# EAGLE schematic Shutter v1 (EAGLE 5.10)
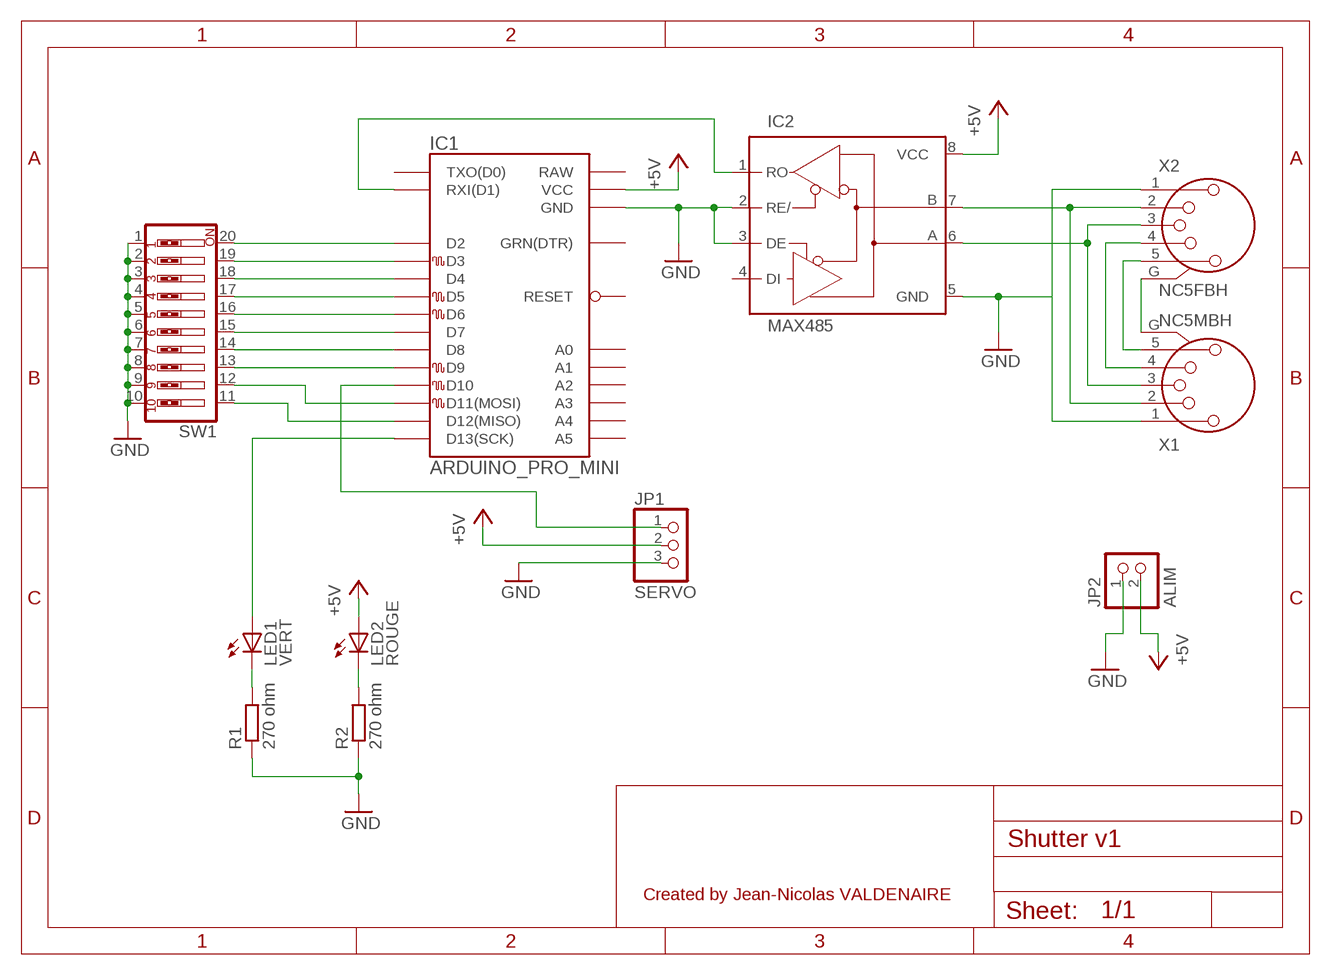
[diagram p0: schematic, sheet 1]

## Parts
IC1  ARDUINO_PRO_MINI  [ARDUINO_PRO_MINI]
IC2  MAX485  MAX3468CPA  [DIL08]
JP1  SERVO  PINHD-1X3  [1X03]
JP2  ALIM  PINHD-1X2  [1X02]
LED1  VERT  LED5MM  [LED5MM]
LED2  ROUGE  LED5MM  [LED5MM]
R1  270 ohm  R-EU_0207/10  [0207/10]
R2  270 ohm  R-EU_0207/10  [0207/10]
SW1  SW_DIP-10  [EDG-10]
X1  NC5MBH  [NC5MBH]
X2  NC5FBH  [NC5FBH]

## Nets
+5V: IC1.VCC1(VCC) IC2.8(VCC) JP1.2 JP2.2 LED2.A
GND: IC1.GND1(GND) IC2.2(RE/) IC2.3(DE) IC2.5(GND) JP1.3 JP2.1 R1.1 R2.1 SW1.1 SW1.2 SW1.3 SW1.4 SW1.5 SW1.6 SW1.7 SW1.8 SW1.9 SW1.10 X1.1 X2.1
N$1: IC1.D12(D12(MISO)) SW1.11
N$2: IC1.RXI(RXI(D1)) IC2.1(RO)
N$3: LED1.K(C) R1.2
N$4: LED2.K(C) R2.2
N$6: IC1.D11(D11(MOSI)) SW1.12
N$7: IC1.D9 SW1.13
N$8: IC1.D8 SW1.14
N$9: IC1.D7 SW1.15
N$10: IC1.D6 SW1.16
N$11: IC1.D5 SW1.17
N$12: IC1.D4 SW1.18
N$13: IC1.D3 SW1.19
N$14: IC1.D2 SW1.20
N$15: IC1.D10 JP1.1
N$16: IC1.D13(D13(SCK)) LED1.A
N$17: X1.G X2.G
N$18: X1.5 X2.5
N$19: X1.4 X2.4
N$20: IC2.6(A) X1.3 X2.3
N$21: IC2.7(B) X1.2 X2.2
Unconnected: IC1.A0 IC1.A1 IC1.A2 IC1.A3 IC1.A4 IC1.A5 IC1.GRN(GRN(DTR)) IC1.RAW IC1.RST1(RESET) IC1.TXO(TXO(D0)) IC2.4(DI)

## Notes on the sheet
- Created by Jean-Nicolas VALDENAIRE

## Library data of the parts
IC1 = Halley:ARDUINO_PRO_MINI
IC2 = maxim:MAX34*: +5V, Fail-Safe, 40Mbps, Profibus RS-485/RS-422 Transceivers Source: MAX3465-MAX3469.pdf
JP1 = pinhead:PINHD-1X3: PIN HEADER
JP2 = pinhead:PINHD-1X2: PIN HEADER
LED1 LED2 = led:LED: LED OSRAM: - CHIPLED LG R971, LG N971, LY N971, LG Q971, LY Q971, LO R971, LY R971 LH N974, LH R974 LS Q976, LO Q976, LY Q976 LO Q996 - Hyper CHIPLED LW Q18S LB Q993, LB Q99A, LB R99A - SideLED LS A670, LO A670, LY A670, LG A670, LP A670 LB A673, LV A673, LT A673, LW A673 LH A674 LY A675 LS A676, LA A676, LO A676, LY A676, LW A676 LS A679, LY A679, LG A679 - Hyper Micro SIDELED® LS Y876, LA Y876, LO Y876, LY Y876 LT Y87S - SmartLED LW L88C, LW L88S LB L89C, LB L89S, LG L890 LS L89K, LO L89K, LY L89K LS L896, LA L896, LO L896, LY L896 - TOPLED LS T670, LO T670, LY T670, LG T670, LP T670 LSG T670, LSP T670, LSY T670, LOP T670, LYG T670 LG T671, LOG T671, LSG T671 LB T673, LV T673, LT T673, LW T673 LH T674 LS T676, LA T676, LO T676, LY T676, LB T676, LH T676, LSB T676, LW T676 LB T67C, LV T67C, LT T67C, LS T67K, LO T67K, LY T67K, LW E67C LS E67B, LA E67B, LO E67B, LY E67B, LB E67C, LV E67C, LT E67C LW T67C LS T679, LY T679, LG T679 LS T770, LO T770, LY T770, LG T770, LP T770 LB T773, LV T773, LT T773, LW T773 LH T774 LS E675, LA E675, LY E675, LS T675 LS T776, LA T776, LO T776, LY T776, LB T776 LHGB T686 LT T68C, LB T68C - Hyper Mini TOPLED® LB M676 - Mini TOPLED Santana® LG M470 LS M47K, LO M47K, LY M47K Source: http://www.osram.convergy.de LUXEON: - LUMILED® LXK2-PW12-R00, LXK2-PW12-S00, LXK2-PW14-U00, LXK2-PW14-V00 LXK2-PM12-R00, LXK2-PM12-S00, LXK2-PM14-U00 LXK2-PE12-Q00, LXK2-PE12-R00, LXK2-PE12-S00, LXK2-PE14-T00, LXK2-PE14-U00 LXK2-PB12-K00, LXK2-PB12-L00, LXK2-PB12-M00, LXK2-PB14-N00, LXK2-PB14-P00, LXK2-PB14-Q00 LXK2-PR12-L00, LXK2-PR12-M00, LXK2-PR14-Q00, LXK2-PR14-R00 LXK2-PD12-Q00, LXK2-PD12-R00, LXK2-PD12-S00 LXK2-PH12-R00, LXK2-PH12-S00 LXK2-PL12-P00, LXK2-PL12-Q00, LXK2-PL12-R00 Source: www.luxeon.com KINGBRIGHT: KA-3528ASYC Source: www.kingbright.com
R1 R2 = resistor:R-EU_: RESISTOR, European symbol
SW1 = special:SW_DIP-10: DIP SWITCH
X1 X2 = con-neutrik_ag:NC5: Neutrik Audio Connector XLR SERIES Stereo 1/4" jack Source: www.neutrik.com/